# Altium schematic sheet CPU.SchDoc: CONTROLADORA MAIS PIPOCA - REVISÃO EMC
size A3; DocumentNumber: 8; SheetNumber: 8; SheetTotal: 17
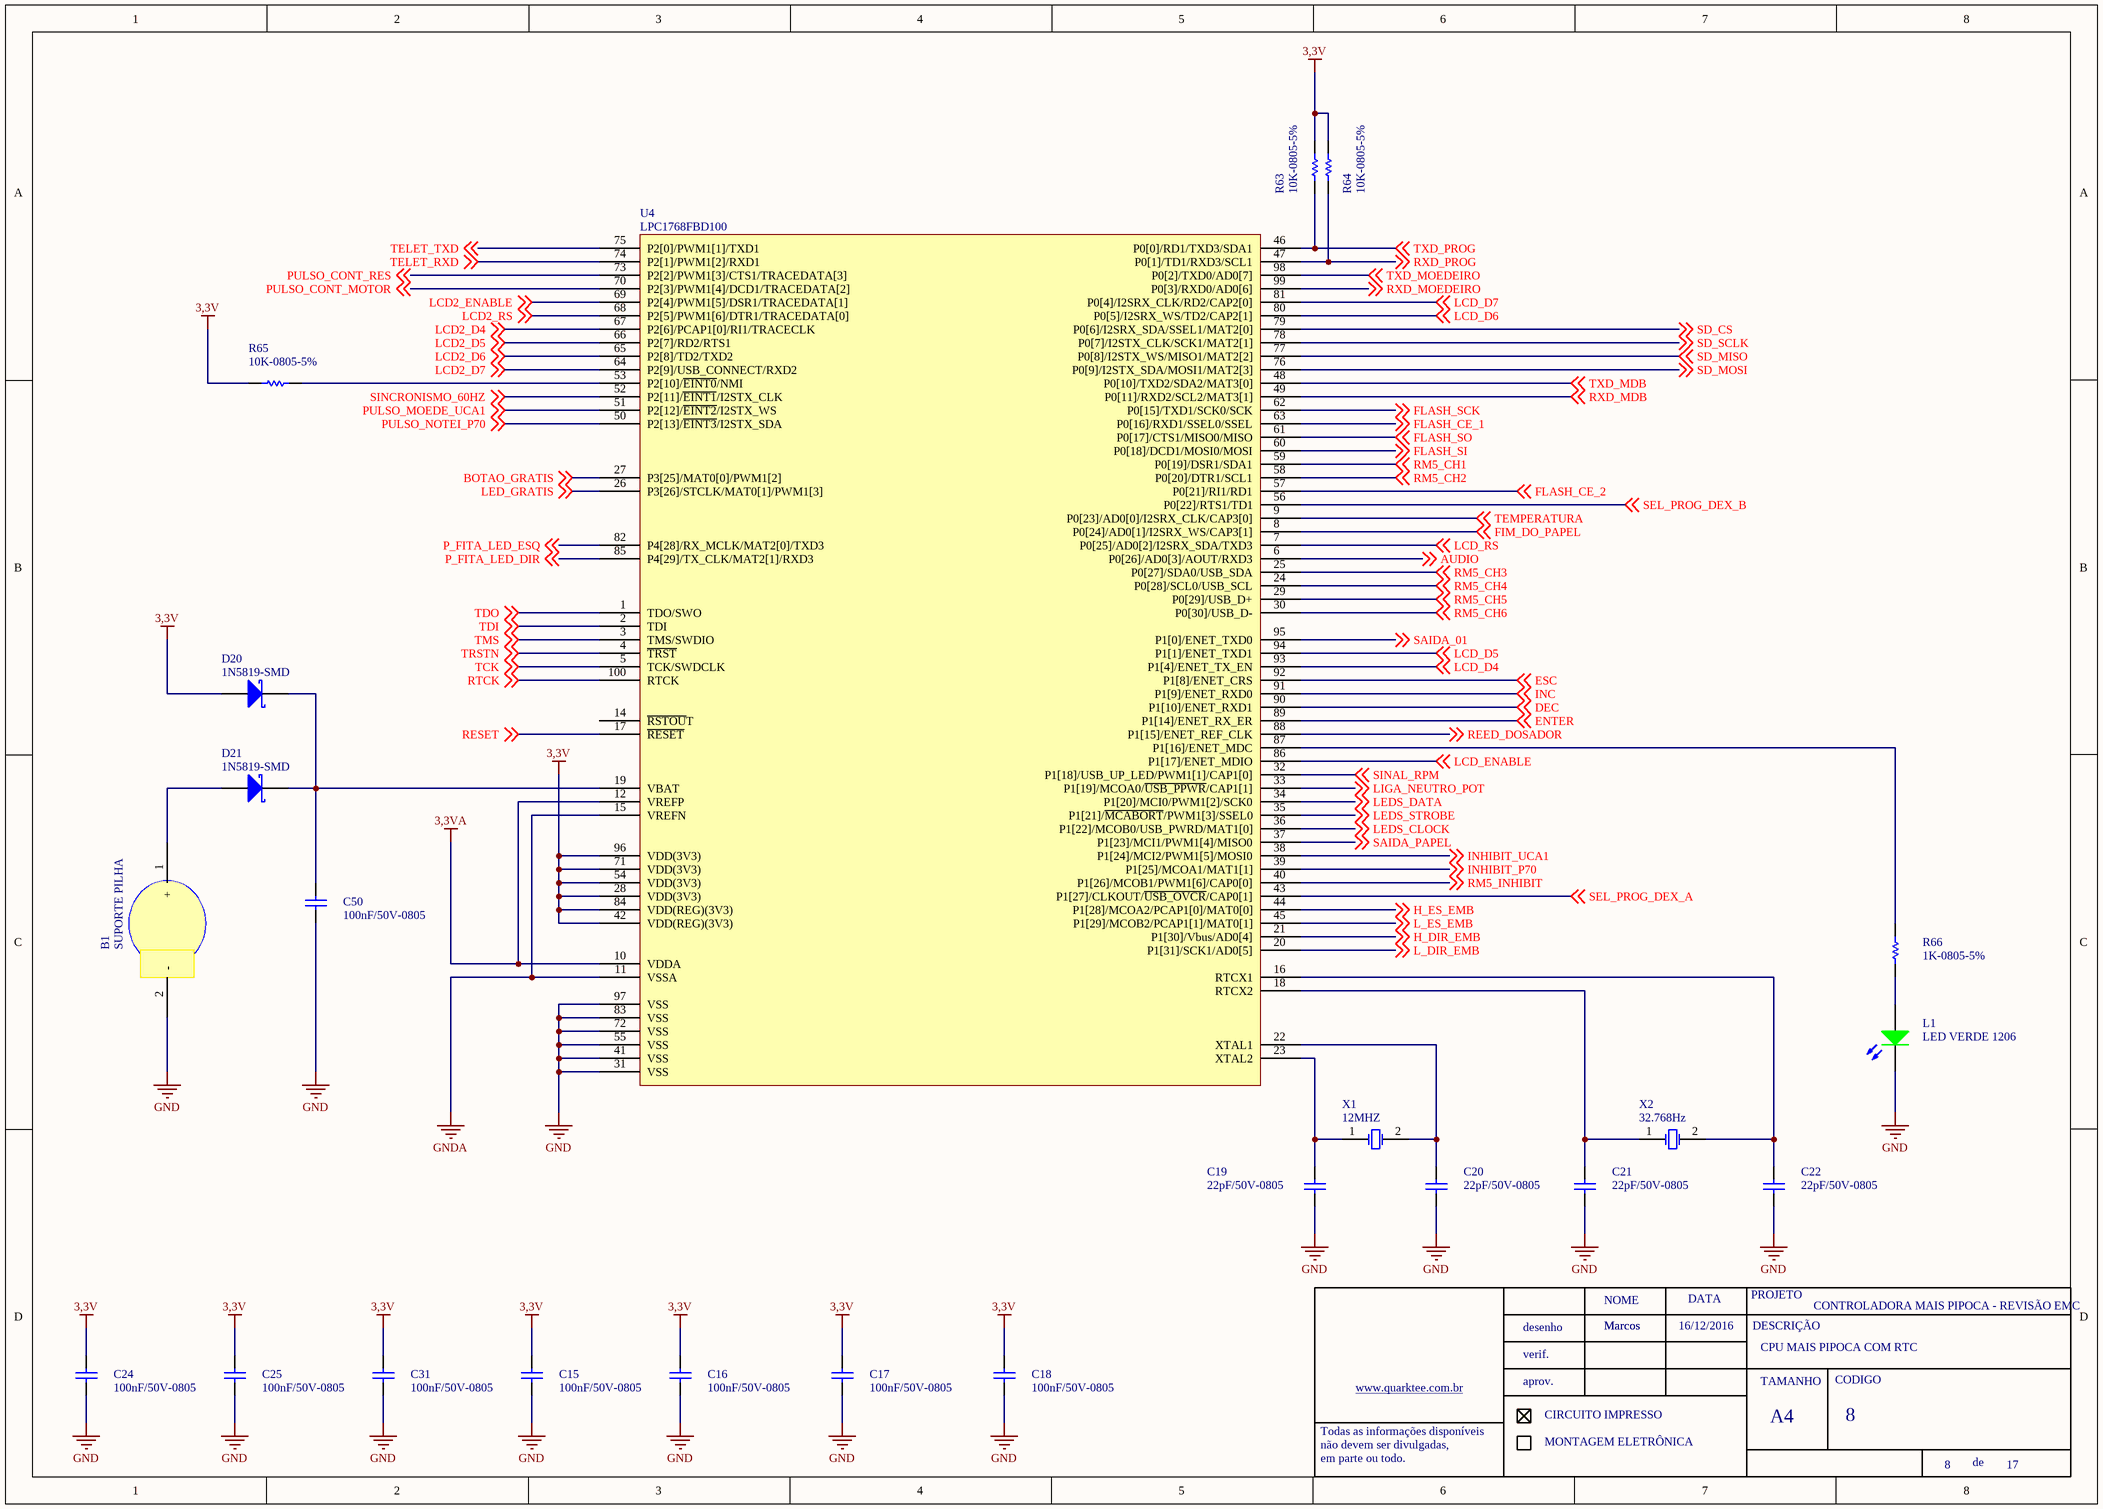
[diagram p0: CPU.SchDoc]

## Parts
B1  SUPORTE PILHA  [SUPORTE PILHA CR2032]
C15  100nF/50V-0805  [0805-REVISADO ONDA]
C16  100nF/50V-0805  [0805-REVISADO ONDA]
C17  100nF/50V-0805  [0805-REVISADO ONDA]
C18  100nF/50V-0805  [0805-REVISADO ONDA]
C19  22pF/50V-0805  [0805-REVISADO ONDA]
C20  22pF/50V-0805  [0805-REVISADO ONDA]
C21  22pF/50V-0805  [0805-REVISADO ONDA]
C22  22pF/50V-0805  [0805-REVISADO ONDA]
C24  100nF/50V-0805  [0805-REVISADO ONDA]
C25  100nF/50V-0805  [0805-REVISADO ONDA]
C31  100nF/50V-0805  [0805-REVISADO ONDA]
C50  100nF/50V-0805  [0805-REVISADO ONDA]
D20  1N5819-SMD
D21  1N5819-SMD
L1  LED VERDE 1206  [LED 1206]
R63  10K-0805-5%  [0805-REVISADO ONDA]
R64  10K-0805-5%  [0805-REVISADO ONDA]
R65  10K-0805-5%  [0805-REVISADO ONDA]
R66  1K-0805-5%  [0805-REVISADO ONDA]
U4  LPC1768FBD100  [LQFP-100 pasta]
X1  12MHZ  [HC49USM]
X2  32.768Hz  [CRISTAL TH3]

## Nets
3,3V: C15.2 C16.2 C17.2 C18.2 C24.2 C25.2 C31.2 D20.1(A) R63.2 R64.2 R65.1 U4.28(VDD(3V3)) U4.42(VDD(REG)(3V3)) U4.54(VDD(3V3)) U4.71(VDD(3V3)) U4.84(VDD(REG)(3V3)) U4.96(VDD(3V3))
3,3VA: U4.10(VDDA) U4.12(VREFP)
GND: B1.2(-) C15.1 C16.1 C17.1 C18.1 C19.1 C20.1 C21.1 C22.1 C24.1 C25.1 C31.1 C50.1 L1.2(K) U4.31(VSS) U4.41(VSS) U4.55(VSS) U4.72(VSS) U4.83(VSS) U4.97(VSS)
GNDA: U4.11(VSSA) U4.15(VREFN)
AUDIO: U4.6(P0[26]/AD0[3]/AOUT/RXD3) ; off-sheet AUDIO
BOTAO_GRATIS: U4.27(P3[25]/MAT0[0]/PWM1[2]) ; off-sheet BOTAO_GRATIS
DEC: U4.90(P1[10]/ENET_RXD1) ; off-sheet DEC
ENTER: U4.89(P1[14]/ENET_RX_ER) ; off-sheet ENTER
ESC: U4.92(P1[8]/ENET_CRS) ; off-sheet ESC
FIM_DO_PAPEL: U4.8(P0[24]/AD0[1]/I2SRX_WS/CAP3[1]) ; off-sheet FIM_DO_PAPEL
FLASH_CE_1: U4.63(P0[16]/RXD1/SSEL0/SSEL) ; off-sheet FLASH_CE_1
FLASH_CE_2: U4.57(P0[21]/RI1/RD1) ; off-sheet FLASH_CE_2
FLASH_SCK: U4.62(P0[15]/TXD1/SCK0/SCK) ; off-sheet FLASH_SCK
FLASH_SI: U4.60(P0[18]/DCD1/MOSI0/MOSI) ; off-sheet FLASH_SI
FLASH_SO: U4.61(P0[17]/CTS1/MISO0/MISO) ; off-sheet FLASH_SO
H_DIR_EMB: U4.21(P1[30]/Vbus/AD0[4]) ; off-sheet H_DIR_EMB
H_ES_EMB: U4.44(P1[28]/MCOA2/PCAP1[0]/MAT0[0]) ; off-sheet H_ES_EMB
INC: U4.91(P1[9]/ENET_RXD0) ; off-sheet INC
INHIBIT_P70: U4.39(P1[25]/MCOA1/MAT1[1]) ; off-sheet INHIBIT_P70
INHIBIT_UCA1: U4.38(P1[24]/MCI2/PWM1[5]/MOSI0) ; off-sheet INHIBIT_UCA1
L_DIR_EMB: U4.20(P1[31]/SCK1/AD0[5]) ; off-sheet L_DIR_EMB
L_ES_EMB: U4.45(P1[29]/MCOB2/PCAP1[1]/MAT0[1]) ; off-sheet L_ES_EMB
LCD2_D4: U4.67(P2[6]/PCAP1[0]/RI1/TRACECLK) ; off-sheet LCD2_D4
LCD2_D5: U4.66(P2[7]/RD2/RTS1) ; off-sheet LCD2_D5
LCD2_D6: U4.65(P2[8]/TD2/TXD2) ; off-sheet LCD2_D6
LCD2_D7: U4.64(P2[9]/USB_CONNECT/RXD2) ; off-sheet LCD2_D7
LCD2_ENABLE: U4.69(P2[4]/PWM1[5]/DSR1/TRACEDATA[1]) ; off-sheet LCD2_ENABLE
LCD2_RS: U4.68(P2[5]/PWM1[6]/DTR1/TRACEDATA[0]) ; off-sheet LCD2_RS
LCD_D4: U4.93(P1[4]/ENET_TX_EN) ; off-sheet LCD_D4
LCD_D5: U4.94(P1[1]/ENET_TXD1) ; off-sheet LCD_D5
LCD_D6: U4.80(P0[5]/I2SRX_WS/TD2/CAP2[1]) ; off-sheet LCD_D6
LCD_D7: U4.81(P0[4]/I2SRX_CLK/RD2/CAP2[0]) ; off-sheet LCD_D7
LCD_ENABLE: U4.86(P1[17]/ENET_MDIO) ; off-sheet LCD_ENABLE
LCD_RS: U4.7(P0[25]/AD0[2]/I2SRX_SDA/TXD3) ; off-sheet LCD_RS
LED_GRATIS: U4.26(P3[26]/STCLK/MAT0[1]/PWM1[3]) ; off-sheet LED_GRATIS
LEDS_CLOCK: U4.36(P1[22]/MCOB0/USB_PWRD/MAT1[0]) ; off-sheet LEDS_CLOCK
LEDS_DATA: U4.34(P1[20]/MCI0/PWM1[2]/SCK0) ; off-sheet LEDS_DATA
LEDS_STROBE: U4.35(P1[21]/~{MCABORT}/PWM1[3]/SSEL0) ; off-sheet LEDS_STROBE
LIGA_NEUTRO_POT: U4.33(P1[19]/MCOA0/~{USB_PPWR}/CAP1[1]) ; off-sheet LIGA_NEUTRO_POT
P_FITA_LED_DIR: U4.85(P4[29]/TX_CLK/MAT2[1]/RXD3) ; off-sheet P_FITA_LED_DIR
P_FITA_LED_ESQ: U4.82(P4[28]/RX_MCLK/MAT2[0]/TXD3) ; off-sheet P_FITA_LED_ESQ
PULSO_CONT_MOTOR: U4.70(P2[3]/PWM1[4]/DCD1/TRACEDATA[2]) ; off-sheet PULSO_CONT_MOTOR
PULSO_CONT_RES: U4.73(P2[2]/PWM1[3]/CTS1/TRACEDATA[3]) ; off-sheet PULSO_CONT_RES
PULSO_MOEDE_UCA1: U4.51(P2[12]/~{EINT2}/I2STX_WS) ; off-sheet PULSO_MOEDE_UCA1
PULSO_NOTEI_P70: U4.50(P2[13]/~{EINT3}/I2STX_SDA) ; off-sheet PULSO_NOTEI_P70
REED_DOSADOR: U4.88(P1[15]/ENET_REF_CLK) ; off-sheet REED_DOSADOR
RESET: U4.17(~{RESET}) ; off-sheet RESET
RM5_CH1: U4.59(P0[19]/DSR1/SDA1) ; off-sheet RM5_CH1
RM5_CH2: U4.58(P0[20]/DTR1/SCL1) ; off-sheet RM5_CH2
RM5_CH3: U4.25(P0[27]/SDA0/USB_SDA) ; off-sheet RM5_CH3
RM5_CH4: U4.24(P0[28]/SCL0/USB_SCL) ; off-sheet RM5_CH4
RM5_CH5: U4.29(P0[29]/USB_D+) ; off-sheet RM5_CH5
RM5_CH6: U4.30(P0[30]/USB_D-) ; off-sheet RM5_CH6
RM5_INHIBIT: U4.40(P1[26]/MCOB1/PWM1[6]/CAP0[0]) ; off-sheet RM5_INHIBIT
RTCK: U4.100(RTCK) ; off-sheet RTCK
RXD_MDB: U4.49(P0[11]/RXD2/SCL2/MAT3[1]) ; off-sheet RXD_MDB
RXD_MOEDEIRO: U4.99(P0[3]/RXD0/AD0[6]) ; off-sheet RXD_MOEDEIRO
RXD_PROG: R64.1 U4.47(P0[1]/TD1/RXD3/SCL1) ; off-sheet RXD_PROG
SAIDA_01: U4.95(P1[0]/ENET_TXD0) ; off-sheet SAIDA_01
SAIDA_PAPEL: U4.37(P1[23]/MCI1/PWM1[4]/MISO0) ; off-sheet SAIDA_PAPEL
SD_CS: U4.79(P0[6]/I2SRX_SDA/SSEL1/MAT2[0]) ; off-sheet SD_CS
SD_MISO: U4.77(P0[8]/I2STX_WS/MISO1/MAT2[2]) ; off-sheet SD_MISO
SD_MOSI: U4.76(P0[9]/I2STX_SDA/MOSI1/MAT2[3]) ; off-sheet SD_MOSI
SD_SCLK: U4.78(P0[7]/I2STX_CLK/SCK1/MAT2[1]) ; off-sheet SD_SCLK
SEL_PROG_DEX_A: U4.43(P1[27]/CLKOUT/~{USB_OVCR}/CAP0[1]) ; off-sheet SEL_PROG_DEX_A
SEL_PROG_DEX_B: U4.56(P0[22]/RTS1/TD1) ; off-sheet SEL_PROG_DEX_B
SINAL_RPM: U4.32(P1[18]/USB_UP_LED/PWM1[1]/CAP1[0]) ; off-sheet SINAL_RPM
SINCRONISMO_60HZ: U4.52(P2[11]/~{EINT1}/I2STX_CLK) ; off-sheet SINCRONISMO_60HZ
TCK: U4.5(TCK/SWDCLK) ; off-sheet TCK
TDI: U4.2(TDI) ; off-sheet TDI
TDO: U4.1(TDO/SWO) ; off-sheet TDO
TELET_RXD: U4.74(P2[1]/PWM1[2]/RXD1) ; off-sheet TELET_RXD
TELET_TXD: U4.75(P2[0]/PWM1[1]/TXD1) ; off-sheet TELET_TXD
TEMPERATURA: U4.9(P0[23]/AD0[0]/I2SRX_CLK/CAP3[0]) ; off-sheet TEMPERATURA
TMS: U4.3(TMS/SWDIO) ; off-sheet TMS
TRSTN: U4.4(~{TRST}) ; off-sheet TRSTN
TXD_MDB: U4.48(P0[10]/TXD2/SDA2/MAT3[0]) ; off-sheet TXD_MDB
TXD_MOEDEIRO: U4.98(P0[2]/TXD0/AD0[7]) ; off-sheet TXD_MOEDEIRO
TXD_PROG: R63.1 U4.46(P0[0]/RD1/TXD3/SDA1) ; off-sheet TXD_PROG
NetB1_1: B1.1(+) D21.1(A)
NetC19_2: C19.2 U4.23(XTAL2) X1.1(OSC1)
NetC20_2: C20.2 U4.22(XTAL1) X1.2(OSC2)
NetC21_2: C21.2 U4.18(RTCX2) X2.1(OSC1)
NetC22_2: C22.2 U4.16(RTCX1) X2.2(OSC2)
NetC50_2: C50.2 D20.2(K) D21.2(K) U4.19(VBAT)
NetL1_1: L1.1(A) R66.1
NetR65_2: R65.2 U4.53(P2[10]/~{EINT0}/NMI)
NetR66_2: R66.2 U4.87(P1[16]/ENET_MDC)

Not connected (* = marked no-connect by the designer): U4 14(~{RSTOU}T)

## Notes on the sheet
- Marcos
- 16/12/2016
- CPU MAIS PIPOCA COM RTC
- NOME
- DATA
- PROJETO
- DESCRIÇÃO
- www.quarktee.com.br
- desenho
- verif.
- aprov.
- TAMANHO
- CODIGO
- Todas as informações disponíveis
- não devem ser divulgadas,
- em parte ou todo.
- CIRCUITO IMPRESSO
- MONTAGEM ELETRÔNICA
- A4
- de

## Library data of the parts
B1 = SUPORTE PILHA CR2032: ERP: 437.00.100
C15-C18 C24 C25 C31 C50 = 100nF/50-0805-NPO: ERP: 104.11.005
C19-C22 = 22pF-0805-NPO: ERP: 104.11.001
D20 D21 = 1N5819: ERP: 121.20.002
L1 = LED VERDE 0603 SMD: LED VERDE 0603 VERDE; ERP: 124.02.011
U4 = LPC1768FDB100: ERP: 110.02.004
X1 = CRISTAL 12MHZ: ERP: 134.01.003
X2 = CRISTAL 32.768 Hz: CRISTAL 32.768Hz; ERP: 134.01.002
R63-R65 = 10K-0805-5%: ERP: 102.11.054
R66 = 1K-0805-5%: ERP: 102.11.042